# EAGLE design SparkBase (EAGLE 7.1.0)
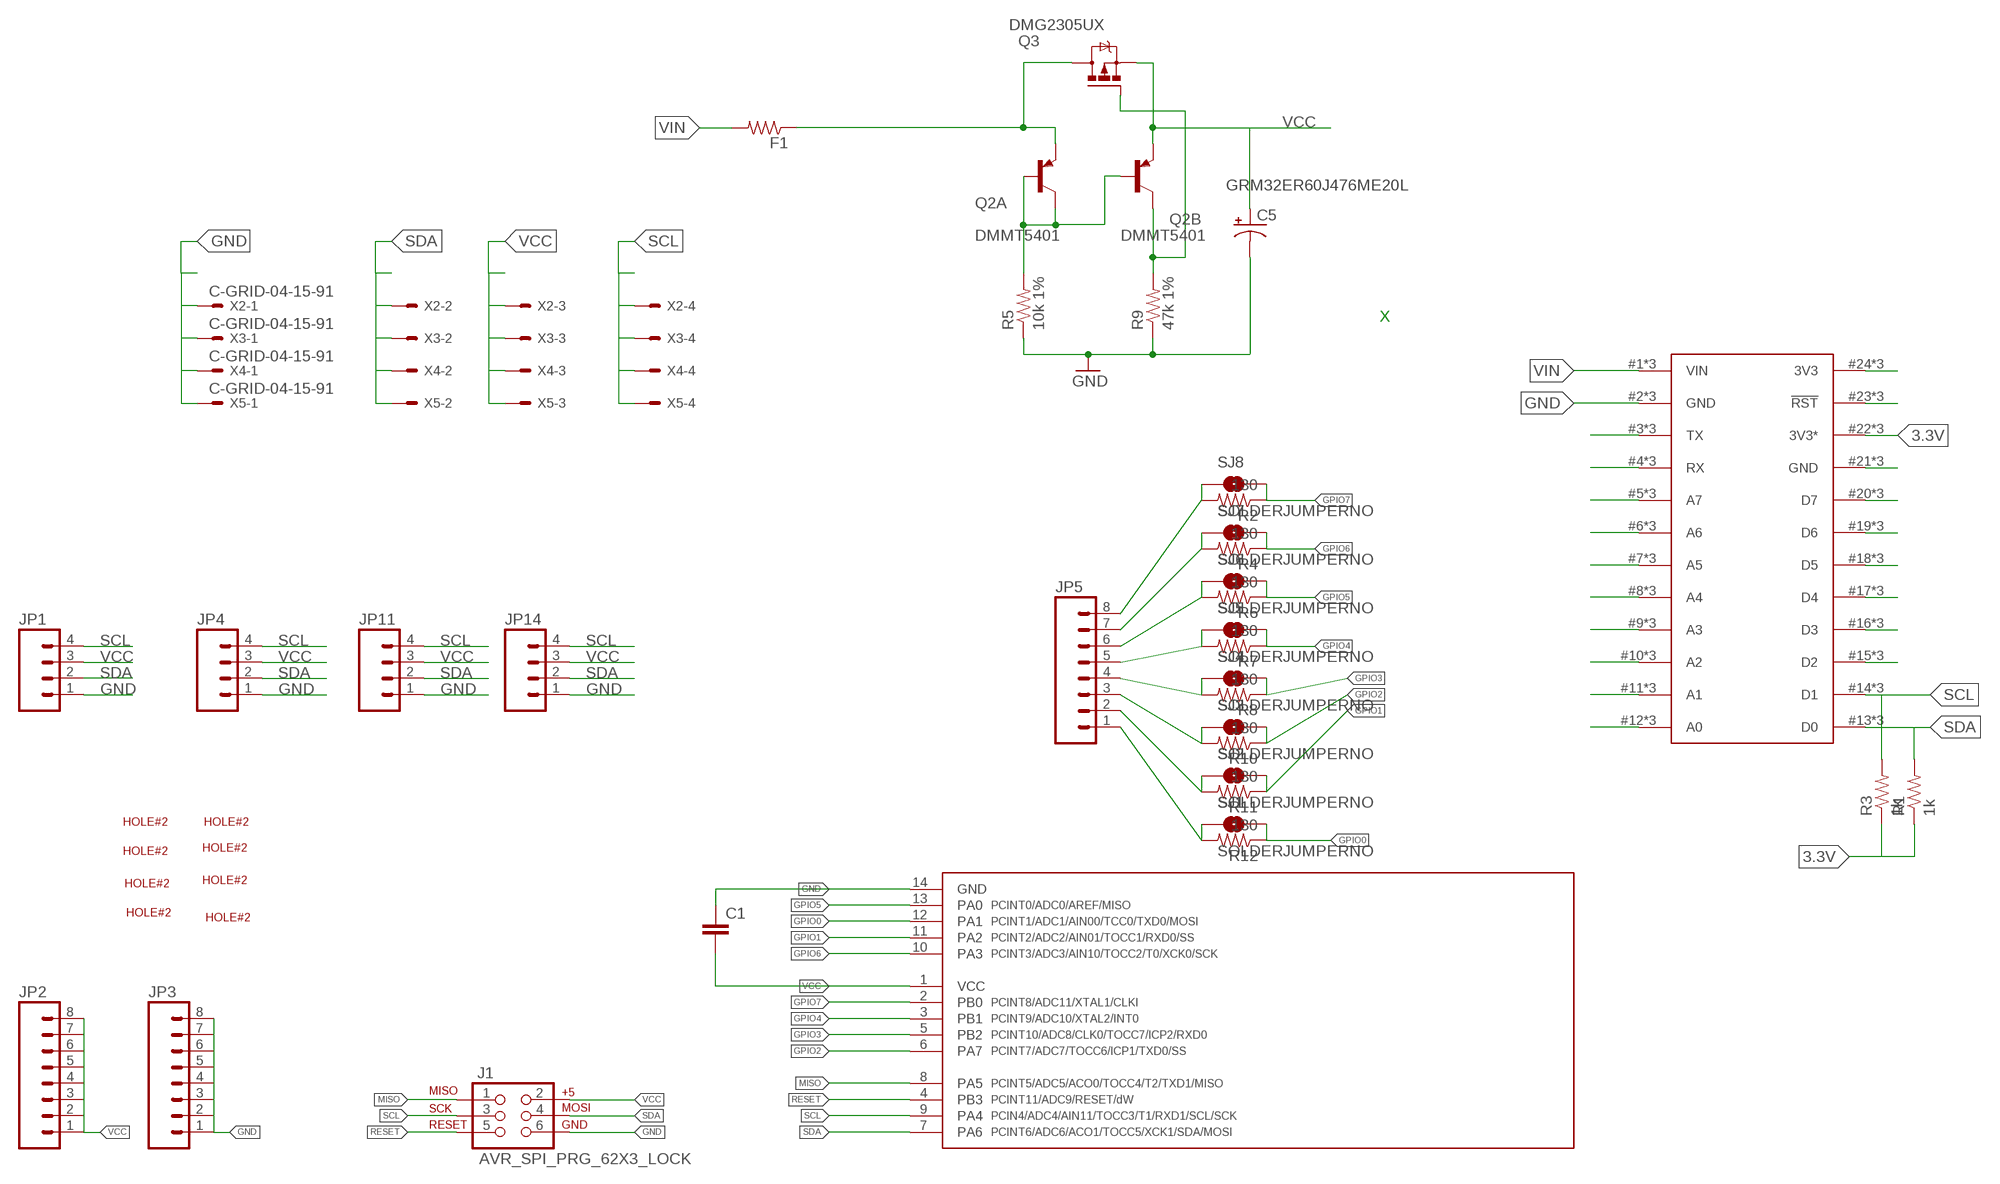
[diagram p0: schematic, sheet 1]

## Parts
C1  CAP0805  [0805]
C5  CAP_POLC  [PANASONIC_C]
F1  RESISTOR0805-RES  [0805]
J1  AVR_SPI_PRG_62X3_LOCK  [2X3_LOCK]
JP1  M04LOCK  [1X04_LOCK]
JP2  M08NO_SILK  [1X08_NO_SILK]
JP3  M08NO_SILK  [1X08_NO_SILK]
JP4  M04LOCK  [1X04_LOCK]
JP5  M08NO_SILK  [1X08_NO_SILK]
JP11  M04LOCK  [1X04_LOCK]
JP14  M04LOCK  [1X04_LOCK]
Q2  DMMT5401  TRANSISTOR-DUAL-PNP  [SOT-26]
Q3  DMG2305UX  IRLML5203  [MICRO3]
R1  1k  RESISTOR0805-RES  [0805]
R2  130  RESISTOR0805-RES  [0805]
R3  1k  RESISTOR0805-RES  [0805]
R4  130  RESISTOR0805-RES  [0805]
R5  10k 1%  RESISTOR0805-RES  [0805]
R6  130  RESISTOR0805-RES  [0805]
R7  130  RESISTOR0805-RES  [0805]
R8  130  RESISTOR0805-RES  [0805]
R9  47k 1%  RESISTOR0805-RES  [0805]
R10  130  RESISTOR0805-RES  [0805]
R11  130  RESISTOR0805-RES  [0805]
R12  130  RESISTOR0805-RES  [0805]
SJ1  SOLDERJUMPERNO  [SJ_2S-NO]
SJ2  SOLDERJUMPERNO  [SJ_2S-NO]
SJ3  SOLDERJUMPERNO  [SJ_2S-NO]
SJ4  SOLDERJUMPERNO  [SJ_2S-NO]
SJ5  SOLDERJUMPERNO  [SJ_2S-NO]
SJ6  SOLDERJUMPERNO  [SJ_2S-NO]
SJ7  SOLDERJUMPERNO  [SJ_2S-NO]
SJ8  SOLDERJUMPERNO  [SJ_2S-NO]
U$2  SPARK_CORE  [SPARK_CORE_STACKABLE]
U$6  TINY841  [SOIC14]
U$7  HOLE#2  [HOLE-#2]
U$8  HOLE#2  [HOLE-#2]
U$9  HOLE#2  [HOLE-#2]
U$10  HOLE#2  [HOLE-#2]
U$11  HOLE#2  [HOLE-#2]
U$12  HOLE#2  [HOLE-#2]
U$13  HOLE#2  [HOLE-#2]
U$14  HOLE#2  [HOLE-#2]
X2  C-GRID-04-15-91  [15-91-04]
X3  C-GRID-04-15-91  [15-91-04]
X4  C-GRID-04-15-91  [15-91-04]
X5  C-GRID-04-15-91  [15-91-04]

## Nets
3.3V: R1.1 R3.1 U$2.22(3V3*) U$2.#22(3V3*) U$2.@22(3V3*)
GND: C1.1 C5.- J1.6 JP1.1 JP3.1 JP3.2 JP3.3 JP3.4 JP3.5 JP3.6 JP3.7 JP3.8 JP4.1 JP11.1 JP14.1 R5.1 R9.1 U$2.2(GND) U$2.#2(GND) U$2.@2(GND) U$6.14(GND) X2.1 X3.1 X4.1 X5.1
GPIO0: R12.1 SJ1.2 U$6.12(PA1)
GPIO1: R11.1 SJ2.2 U$6.11(PA2)
GPIO2: R10.1 SJ3.2 U$6.6(PA7)
GPIO3: R8.1 SJ4.2 U$6.5(PB2)
GPIO4: R7.1 SJ5.2 U$6.3(PB1)
GPIO5: R6.1 SJ6.2 U$6.13(PA0)
GPIO6: R4.1 SJ7.2 U$6.10(PA3)
GPIO7: R2.1 SJ8.2 U$6.2(PB0)
MISO: J1.1 U$6.8(PA5)
N$1: U$2.3(TX) U$2.#3(TX) U$2.@3(TX)
N$2: U$2.4(RX) U$2.#4(RX) U$2.@4(RX)
N$3: U$2.5(A7) U$2.#5(A7) U$2.@5(A7)
N$4: U$2.6(A6) U$2.#6(A6) U$2.@6(A6)
N$5: U$2.7(A5) U$2.#7(A5) U$2.@7(A5)
N$6: U$2.8(A4) U$2.#8(A4) U$2.@8(A4)
N$7: U$2.9(A3) U$2.#9(A3) U$2.@9(A3)
N$8: U$2.10(A2) U$2.#10(A2) U$2.@10(A2)
N$9: U$2.11(A1) U$2.#11(A1) U$2.@11(A1)
N$10: U$2.12(A0) U$2.#12(A0) U$2.@12(A0)
N$11: U$2.24(3V3) U$2.#24(3V3) U$2.@24(3V3)
N$12: U$2.23(!RST) U$2.#23(!RST) U$2.@23(!RST)
N$13: U$2.21(GND) U$2.#21(GND) U$2.@21(GND)
N$14: Q2.1(A:C) Q2.2(A:B) Q2.3(B:B) R5.2
N$15: U$2.20(D7) U$2.#20(D7) U$2.@20(D7)
N$16: Q2.4(B:C) Q3.1(G) R9.2
N$17: U$2.19(D6) U$2.#19(D6) U$2.@19(D6)
N$18: U$2.18(D5) U$2.#18(D5) U$2.@18(D5)
N$19: U$2.17(D4) U$2.#17(D4) U$2.@17(D4)
N$20: U$2.16(D3) U$2.#16(D3) U$2.@16(D3)
N$21: U$2.15(D2) U$2.#15(D2) U$2.@15(D2)
N$22: JP5.1 R12.2 SJ1.1
N$23: JP5.2 R11.2 SJ2.1
N$24: JP5.3 R10.2 SJ3.1
N$25: JP5.4 R8.2 SJ4.1
N$26: JP5.5 R7.2 SJ5.1
N$27: JP5.6 R6.2 SJ6.1
N$28: JP5.7 R4.2 SJ7.1
N$29: JP5.8 R2.2 SJ8.1
RESET: J1.5 U$6.4(PB3)
SCL: J1.3 JP1.4 JP4.4 JP11.4 JP14.4 R3.2 U$2.14(D1) U$2.#14(D1) U$2.@14(D1) U$6.9(PA4) X2.4 X3.4 X4.4 X5.4
SDA: J1.4 JP1.2 JP4.2 JP11.2 JP14.2 R1.2 U$2.13(D0) U$2.#13(D0) U$2.@13(D0) U$6.7(PA6) X2.2 X3.2 X4.2 X5.2
VCC: C1.2 C5.+ J1.2 JP1.3 JP2.1 JP2.2 JP2.3 JP2.4 JP2.5 JP2.6 JP2.7 JP2.8 JP4.3 JP11.3 JP14.3 Q2.5(B:E) Q3.2(S) U$6.1(VCC) X2.3 X3.3 X4.3 X5.3
VIN: F1.2 U$2.1(VIN) U$2.#1(VIN) U$2.@1(VIN)
VREG: F1.1 Q2.6(A:E) Q3.3(D)
Unconnected: U$7.P$1(HOLE) U$8.P$1(HOLE) U$9.P$1(HOLE) U$10.P$1(HOLE) U$11.P$1(HOLE) U$12.P$1(HOLE) U$13.P$1(HOLE) U$14.P$1(HOLE)

## Notes on the sheet
- GRM32ER60J476ME20L
- X

## Library data of the parts
C1 = IntegerLabs:CAP: Capacitor
C5 = IntegerLabs:CAP_POL: Capacitor Polarized These are standard SMD and PTH capacitors. Normally 10uF, 47uF, and 100uF in electrolytic and tantalum varieties. Always verify the external diameter of the through hole cap, it varies with capacity, voltage, and manufacturer. The EIA devices should be standard.
F1 R1-R12 = SparkFun-Passives:RESISTOR: Resistor Basic schematic elements and footprints for 0603, 1206, and PTH resistors.
J1 = SparkFun-Connectors:AVR_SPI_PRG_6: AVR ISP 6 Pin This is the reduced ISP connector for AVR programming. Common on Arduino. This footprint will take up less PCB space and can be used with a 10-pin to 6-pin adapter such as SKU: BOB-08508
JP1 JP4 JP11 JP14 = SparkFun-Connectors:M04: Header 4 Standard 4-pin 0.1" header. Use with straight break away headers (SKU : PRT-00116), right angle break away headers (PRT-00553), swiss pins (PRT-00743), machine pins (PRT-00117), and female headers (PRT-00115). Molex polarized connector foot print use with SKU : PRT-08231 with associated crimp pins and housings. 1MM SMD Version SKU: PRT-10208
JP2 JP3 JP5 = SparkFun-Connectors:M08: Header 8 Standard 8-pin 0.1" header. Use with straight break away headers (SKU : PRT-00116), right angle break away headers (PRT-00553), swiss pins (PRT-00743), machine pins (PRT-00117), and female headers (PRT-00115).
Q2 = IntegerLabs:TRANSISTOR-DUAL-PNP: PNP Transistor
Q3 = transistor-power:IRLML5203: HEXFET P-Channel Power MOSFET
SJ1-SJ8 = SparkFun-Passives:SOLDERJUMPER: Solder Jumper Standard SMD solder jumper. Used to automate production. Two varients : Normally Open and Normally Closed are the same, but have different paste layers. NC will have a large amount of paste and should jumper during reflow.; NOBOM: 1
U$2 = Spark:SPARK_CORE
U$6 = IntegerLabs:TINY841
U$7-U$14 = IntegerLabs:HOLE; NOBOM: 1
X2-X5 = con-molex:C-GRID-04: CONNECTOR wire to board 2.54 mm (0.100") pitch header; OC_FARNELL: unknown; OC_NEWARK: unknown

## Board
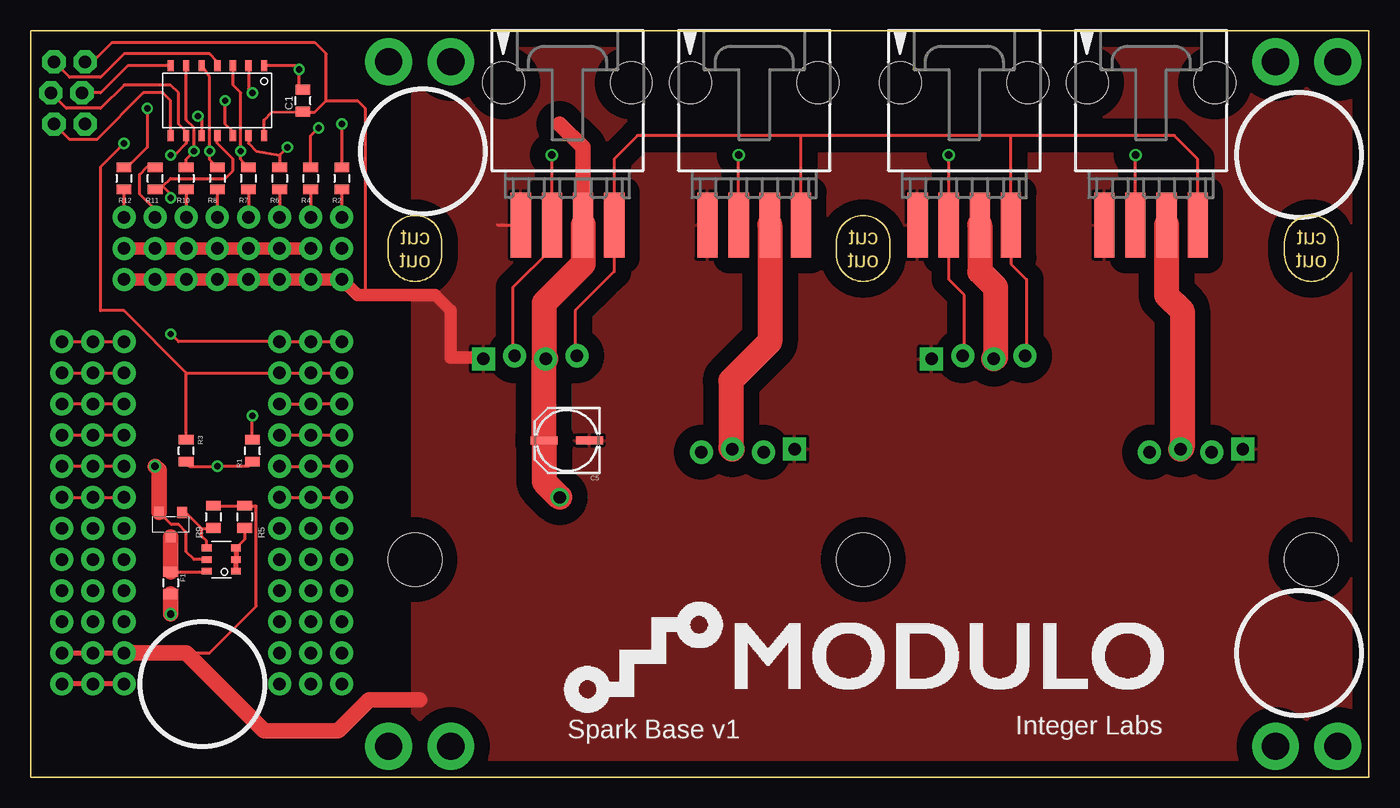
[diagram p1: board, top side]
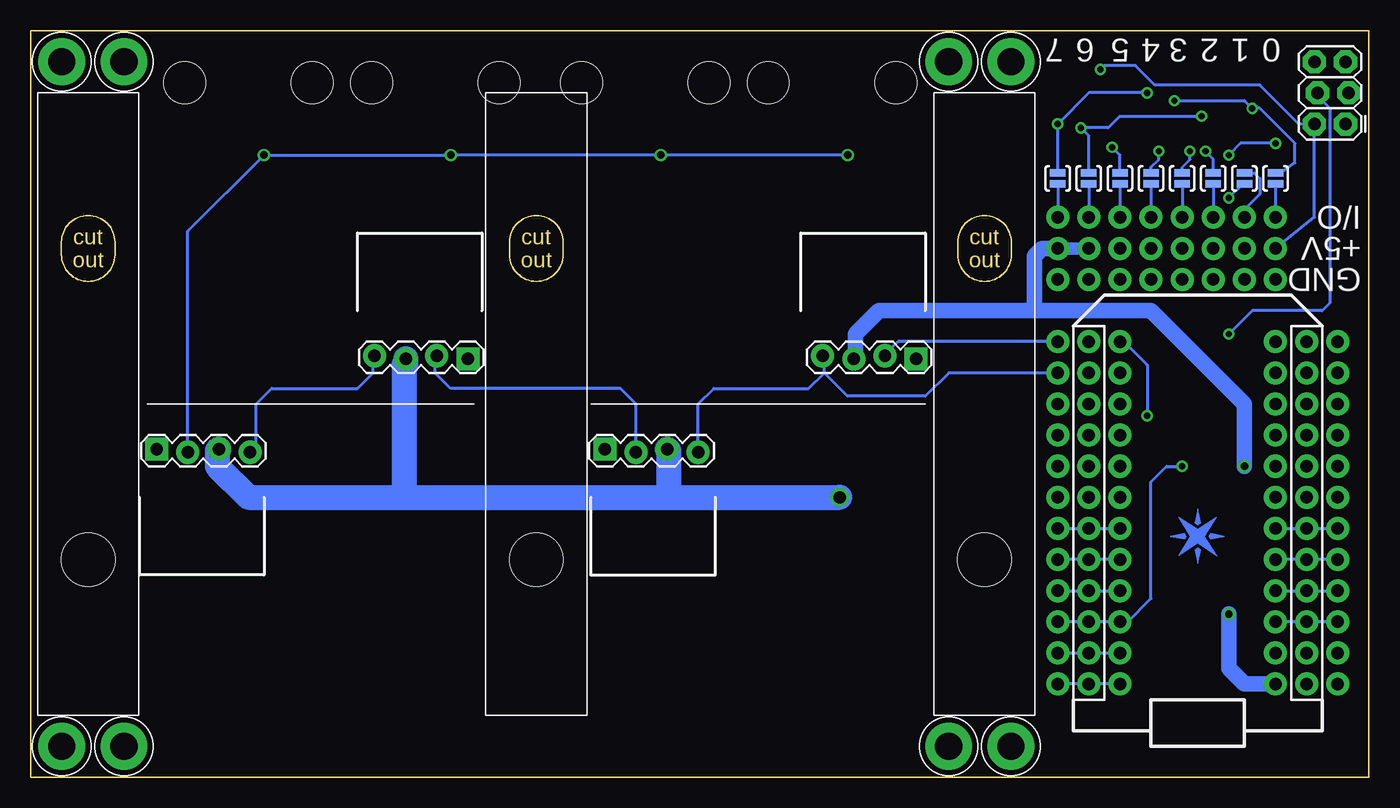
[diagram p2: board, bottom side, seen from below]

Size 109.22 x 60.96 mm. Coordinates in mm from the lower left corner, seen from the top.
Outline: 109.22,0 109.22,60.96 0,60.96 0,0 109.22,0
Copper layers (1*16): Top 0.0178mm / dielectric 59mil / Bottom 0.0178mm
Design rules "SSC-EAGLE-2Lyr_v1.0.0.3 *": minimum track width 6mil, minimum drill 14mil, track to track 6mil, track to pad 6mil, pad to pad 6mil, via to via 6mil, smd to smd 6mil, copper to edge 20mil, drill to drill 16mil, minimum pad ring 8mil, minimum via ring 8mil, stop-mask expansion 3mil, vias tented up to drill 25mil, thermal gap 10mil

### Footprints (pad centres in the part's own frame; a part is rotated, then mirrored left to right if it is on the bottom)
0805 = smd 0.8 x 1.2: 1 -0.9,0; 2 0.9,0
PANASONIC_C = smd 2.2 x 0.65: + 1.9,-0.2; - -1.8,-0.2
2X3_LOCK = drill 1.016 pad 1.88 octagon: 1 0,0; 2 0,2.54; 3 2.54,-0.254; 4 2.54,2.286; 5 5.08,0; 6 5.08,2.54
1X04_LOCK = drill 1.016 pad 1.88 square: 1 0,0.127 | drill 1.016 pad 1.88: 2 2.54,-0.127; 3 5.08,0.127; 4 7.62,-0.127
1X08_NO_SILK = drill 1.016 pad 1.88: 1 0,0; 2 2.54,0; 3 5.08,0; 4 7.62,0; 5 10.16,0; 6 12.7,0; 7 15.24,0; 8 17.78,0
SOT-26 = smd 0.55 x 0.8: 1 -0.95,-1.2; 2 0,-1.2; 3 0.95,-1.2; 4 0.95,1.2; 5 0,1.2; 6 -0.95,1.2
MICRO3 = smd 0.8 x 0.9: 1 -0.95,-1; 2 0.95,-1; 3 0,1
SJ_2S-NO = smd 0.635 x 1.27: 1 -0.45,0; 2 0.45,0
SPARK_CORE_STACKABLE = drill 1.016 pad 1.88: 1 -8.89,13.97; 2 -8.89,11.43; 3 -8.89,8.89; 4 -8.89,6.35; 5 -8.89,3.81; 6 -8.89,1.27; 7 -8.89,-1.27; 8 -8.89,-3.81; 9 -8.89,-6.35; 10 -8.89,-8.89; 11 -8.89,-11.43; 12 -8.89,-13.97; 13 8.89,-13.97; 14 8.89,-11.43; 15 8.89,-8.89; 16 8.89,-6.35; 17 8.89,-3.81; 18 8.89,-1.27; 19 8.89,1.27; 20 8.89,3.81; 21 8.89,6.35; 22 8.89,8.89; 23 8.89,11.43; 24 8.89,13.97; #1 -6.35,13.97; #2 -6.35,11.43; #3 -6.35,8.89; #4 -6.35,6.35; #5 -6.35,3.81; #6 -6.35,1.27; #7 -6.35,-1.27; #8 -6.35,-3.81; #9 -6.35,-6.35; #10 -6.35,-8.89; #11 -6.35,-11.43; #12 -6.35,-13.97; #13 11.43,-13.97; #14 11.43,-11.43; #15 11.43,-8.89; #16 11.43,-6.35; #17 11.43,-3.81; #18 11.43,-1.27; #19 11.43,1.27; #20 11.43,3.81; #21 11.43,6.35; #22 11.43,8.89; #23 11.43,11.43; #24 11.43,13.97; @1 -11.43,13.97; @2 -11.43,11.43; @3 -11.43,8.89; @4 -11.43,6.35; @5 -11.43,3.81; @6 -11.43,1.27; @7 -11.43,-1.27; @8 -11.43,-3.81; @9 -11.43,-6.35; @10 -11.43,-8.89; @11 -11.43,-11.43; @12 -11.43,-13.97; @13 6.35,-13.97; @14 6.35,-11.43; @15 6.35,-8.89; @16 6.35,-6.35; @17 6.35,-3.81; @18 6.35,-1.27; @19 6.35,1.27; @20 6.35,3.81; @21 6.35,6.35; @22 6.35,8.89; @23 6.35,11.43; @24 6.35,13.97
CARD-GUIDE-2" = hole 4.369: 0,-12.7
SOIC14 = smd 0.508 x 0.889: 1 0,-3.175; 2 1.27,-3.175; 3 2.54,-3.175; 4 3.81,-3.175; 5 5.08,-3.175; 6 6.35,-3.175; 7 7.62,-3.175; 8 7.62,2.54; 9 6.35,2.54; 10 5.08,2.54; 11 3.81,2.54; 12 2.54,2.54; 13 1.27,2.54; 14 0,2.54
HOLE-#2 = drill 2.223 pad 3.81: P$1 0,0
15-91-04 = smd 1.651 x 5.334: 1 -3.81,-10.795; 2 -1.27,-10.795; 3 1.27,-10.795; 4 3.81,-10.795 | hole 3.404: -5.207,0.838; 5.207,0.838

### Placement (x,y rotation side)
C1  22.23,55.24 90 top
C5  43.81,27.3 180 top
F1  11.43,15.88 270 top
J1  1.91,53.34 90 bottom
JP1  98.93,26.67 0 bottom
JP2  7.62,43.18 180 bottom
JP3  7.62,40.64 180 bottom
JP4  73.53,34.29 180 bottom
JP5  7.62,45.72 180 bottom
JP11  62.36,26.67 0 bottom
JP14  36.96,34.29 180 bottom
Q2  15.56,17.78 90 top
Q3  11.43,20.64 180 top
R1  18.1,26.67 90 top
R2  25.4,48.9 270 top
R3  12.7,26.67 90 top
R4  22.86,48.9 270 top
R5  17.46,21.27 270 top
R6  20.32,48.9 270 top
R7  17.78,48.9 270 top
R8  15.24,48.9 270 top
R9  14.92,21.27 270 top
R10  12.7,48.9 270 top
R11  10.16,48.9 90 top
R12  7.62,48.9 270 top
SJ1  7.62,48.9 90 bottom
SJ2  10.16,48.9 270 bottom
SJ3  12.7,48.9 90 bottom
SJ4  15.24,48.9 90 bottom
SJ5  17.78,48.9 90 bottom
SJ6  20.32,48.9 90 bottom
SJ7  22.86,48.9 90 bottom
SJ8  25.4,48.9 90 bottom
U$1  [SPARK_LOGO_PLUS_PLANE]  13.97,19.68 0 bottom
U$2  13.97,21.59 180 bottom
U$3  [CARD-GUIDE-2"]  104.52,30.48 0 bottom
U$4  [CARD-GUIDE-2"]  67.94,30.48 0 bottom
U$5  [CARD-GUIDE-2"]  31.37,30.48 0 bottom
U$6  19.05,54.93 180 top
U$7  106.68,2.54 0 bottom
U$8  34.29,58.42 0 bottom
U$9  34.29,2.54 0 bottom
U$10  101.6,2.54 0 bottom
U$11  106.68,58.42 0 bottom
U$12  29.21,58.42 0 bottom
U$13  101.6,58.42 0 bottom
U$14  29.21,2.54 0 bottom
U$15  [LOGO_WITH_TEXT_0.5]  43.18,5.08 0 top
X2  76.2,55.88 0 top
X3  59.05,55.88 0 top
X4  43.81,55.88 0 top
X5  91.44,55.88 0 top

### Tracks (layer width: path | path; a pad name or v marks a point on that pad's centre or on a via)
3.3V  (via drill 0.51 pad 0.25)
  Top 0.254: R1.1 18.1,25.72 17.78,25.4 v15.24,25.4 12.96,25.4 R3.1
  Bottom 0.254: U$2.#22 U$2.22 U$2.@22 19.68,12.7 17.78,14.61 17.78,24.13 16.51,25.4 v15.24,25.4
GND
  Top 0.254: R9.1 R5.1 18.36,22.17 18.41,22.12 18.41,13.97 14.61,10.16 12.7,10.16 | 38.1,45.09 X4.1 | J1.6 5.08,58.42 6.67,60.01 23.18,60.01 24.13,59.05 24.13,55.24 | 24.13,55.24 26.67,55.24 27.3,54.61 27.3,39.37 | U$6.14 19.05,53.66 19.68,54.29 C1.1 22.59,54.34 22.54,54.29 23.18,54.29 24.13,55.24
  Top 0.406: U$2.@2 U$2.2 U$2.#2
  Top 1.016: JP14.1 36.83,34.29 34.29,34.29 34.29,38.1 33.02,39.37 27.3,39.37 26.67,39.37 JP3.8 JP3.7 JP3.6 JP3.5 JP3.4 JP3.3 JP3.2 JP3.1
  Top 1.27: U$2.#2 12.7,10.16 19.05,3.81 25.08,3.81 27.62,6.35 31.75,6.35
  pour Top (isolate 1.27): 109.22,0 109.22,60.96 31.11,60.96 31.11,0
GPIO0  (via drill 0.51 pad 0.25)
  Top 0.254: U$6.12 16.51,52.7 15.88,53.34 v15.88,55.24 | v9.53,54.61 9.53,51.44 7.88,49.8 R12.1
  Bottom 0.254: v15.88,55.24 10.16,55.24 v9.53,54.61 8.89,54.61 6.03,51.75 6.03,50.16 7.17,49.34 SJ1.2
GPIO1  (via drill 0.51 pad 0.25)
  Top 0.254: U$6.11 15.24,51.75 16.51,50.48 16.51,49.53 15.88,48.9 11.43,48.9 10.79,48.26 | R11.1 10.53,47.99 10.79,48.26 | v11.43,47.31 11.43,47.62 10.79,48.26
  Bottom 0.254: SJ2.2 10.29,48.45 v11.43,47.31
GPIO2  (via drill 0.51 pad 0.25)
  Top 0.254: U$6.6 12.7,53.66 13.34,53.02 v13.34,51.12 12.7,50.48 R10.1
  Bottom 0.254: SJ3.2 12.7,50.48 v13.34,51.12
GPIO3  (via drill 0.51 pad 0.25)
  Top 0.254: U$6.5 14.61,57.15 v14.61,51.12 14.61,50.43 R8.1
  Bottom 0.254: SJ4.2 R8.1 14.61,50.43 v14.61,51.12
GPIO4  (via drill 0.51 pad 0.25)
  Top 0.254: U$6.3 16.51,56.52 17.14,55.88 v17.14,51.12 17.14,50.43 R7.1
  Bottom 0.254: SJ5.2 R7.1 17.14,50.43 v17.14,51.12
GPIO5  (via drill 0.51 pad 0.25)
  Top 0.254: U$6.13 17.78,51.75 18.41,51.12 20.32,50.8 | 20.32,50.8 R6.1 | v20.95,51.44 20.32,50.8
  Bottom 0.254: SJ6.2 20.32,50.8 v20.95,51.44
GPIO6  (via drill 0.51 pad 0.25)
  Top 0.254: v13.65,53.98 13.97,53.66 U$6.10 | R4.1 22.86,52.39 v23.5,53.02
  Bottom 0.254: v13.65,53.98 20.32,53.98 21.27,53.02 v23.5,53.02 22.86,52.39 SJ7.2
GPIO7  (via drill 0.51 pad 0.25)
  Top 0.254: U$6.2 17.78,56.2 v18.1,55.88 | v25.4,53.34 R2.1
  Bottom 0.254: v18.1,55.88 22.86,55.88 v25.4,53.34 SJ8.2
MISO
  Top 0.254: U$6.8 11.43,55.24 10.79,55.88 9.21,55.88 5.4,52.07 3.17,52.07 J1.1
N$1
  Bottom 0.254: U$2.@3 U$2.3 U$2.#3
N$2
  Bottom 0.254: U$2.#4 U$2.4 U$2.@4
N$3
  Bottom 0.254: U$2.@5 U$2.5 U$2.#5
N$4
  Bottom 0.254: U$2.#6 U$2.6 U$2.@6
N$5
  Top 0.254: U$2.@7 U$2.7 U$2.#7
N$6
  Top 0.254: U$2.#8 U$2.8 U$2.@8
N$7
  Top 0.254: U$2.@9 U$2.9 U$2.#9
N$8
  Top 0.254: U$2.#10 U$2.10 U$2.@10
N$9
  Top 0.254: U$2.@11 U$2.11 U$2.#11
N$10
  Top 0.254: U$2.@12 U$2.12 U$2.#12
N$11
  Bottom 0.254: U$2.@24 U$2.24 U$2.#24
N$12
  Bottom 0.254: U$2.#23 U$2.23 U$2.@23
N$13
  Bottom 0.254: U$2.#21 U$2.21 U$2.@21
N$14
  Top 0.254: R5.2 17.46,19.43 Q2.3
  Top 0.406: Q2.3 Q2.2 Q2.1
N$15
  Bottom 0.254: U$2.@20 U$2.20 U$2.#20
N$16
  Top 0.254: Q3.1 12.65,21.64 13.97,20.32 | 13.97,20.32 14.87,20.32 R9.2 | Q2.4 14.36,19.3 13.97,19.68 13.97,20.32
N$17
  Bottom 0.254: U$2.#19 U$2.19 U$2.@19
N$18
  Top 0.254: U$2.@18 U$2.18 U$2.#18
N$19
  Top 0.254: U$2.#17 U$2.17 U$2.@17
N$20
  Top 0.254: U$2.@16 U$2.16 U$2.#16
N$21
  Top 0.254: U$2.#15 U$2.15 U$2.@15
N$22
  Top 0.254: JP5.1 R12.2
  Bottom 0.254: SJ1.1 JP5.1
N$23
  Top 0.254: JP5.2 10.16,46.35 8.89,47.62 8.89,49.21 9.53,49.85 10.11,49.85 R11.2
  Bottom 0.254: SJ2.1 9.34,49.34 8.89,48.9 8.89,47.62 10.16,46.35 JP5.2
N$24
  Top 0.254: R10.2 JP5.3
  Bottom 0.254: SJ3.1 JP5.3
N$25
  Top 0.254: R8.2 JP5.4
  Bottom 0.254: SJ4.1 JP5.4
N$26
  Top 0.254: R7.2 JP5.5
  Bottom 0.254: SJ5.1 JP5.5
N$27
  Top 0.254: R6.2 JP5.6
  Bottom 0.254: SJ6.1 JP5.6
N$28
  Top 0.254: R4.2 JP5.7
  Bottom 0.254: SJ7.1 JP5.7
N$29
  Top 0.254: R2.2 JP5.8
  Bottom 0.254: SJ8.1 JP5.8
RESET
  Top 0.254: U$6.4 15.24,58.42 14.61,59.05 7.62,59.05 5.71,57.15 3.17,57.15 J1.5
SCL  (via drill 0.51 pad 0.25)
  Top 0.254: JP4.4 81.28,34.54 81.28,40.64 80.01,41.91 X2.4 80.01,52.39 | X5.4 95.25,50.48 93.34,52.39 80.01,52.39 | 80.01,52.39 62.87,52.39 | 62.87,52.39 49.53,52.39 47.62,50.48 X4.4 47.62,41.27 44.45,38.1 44.45,34.54 JP14.4 | X3.4 62.87,52.39 | R3.2 12.7,33.02 | 12.7,33.02 U$2.@14 U$2.14 U$2.#14 | J1.3 2.92,54.61 5.71,54.61 7.62,56.52 11.43,56.52 12.06,55.88 12.06,53.34 12.7,52.7 U$6.9 12.7,51.75 11.75,50.8 v11.43,50.8 | 12.7,33.02 7.62,38.1 5.71,38.1 5.71,49.85 v7.62,51.75
  Bottom 0.254: JP1.4 90.93,26.54 90.81,26.67 90.81,30.48 89.53,31.75 82.55,31.75 81.28,33.02 81.28,34.29 JP4.4 | JP11.4 54.74,30.48 53.47,31.75 45.72,31.75 44.45,33.02 | 44.45,33.02 44.45,34.29 44.7,34.29 JP14.4 | v7.62,51.75 10.48,51.75 v11.43,50.8 | U$2.#14 34.29,33.02 36.2,31.11 42.55,31.11 44.45,33.02
SDA  (via drill 0.51 pad 0.25, 0.6)
  Top 0.254: JP14.2 39.37,34.54 39.37,40.01 42.55,43.18 X4.2 v42.55,50.8 | v74.93,50.8 X2.2 74.93,40.64 76.2,39.37 76.2,34.92 76.07,34.8 JP4.2 | X5.2 v90.17,50.8 | X3.2 v57.78,50.8 | U$6.7 7.94,58.1 5.71,55.88 J1.4 | U$2.#13 U$2.13 U$2.@13 12.06,35.56 v11.43,36.2 | R1.2 v18.1,29.53
  Bottom 0.254: v42.55,50.8 v57.78,50.8 v74.93,50.8 v90.17,50.8 96.39,44.58 JP1.2 | JP11.2 59.82,30.48 61.09,31.75 74.93,31.75 76.2,33.02 76.2,34.29 JP4.2 | U$2.#13 38.42,35.56 39.37,34.61 39.37,34.54 JP14.2 | J1.4 4.19,55.63 3.17,54.61 3.17,38.73 3.81,38.1 9.53,38.1 v11.43,36.2 | U$2.@13 20,35.56 18.1,33.66 v18.1,29.53
VCC  (via drill 0.51 pad 0.25, 0.6, 1)
  Top 0.254: Q2.5 13.34,17.78 12.7,18.41 12.7,20 12.06,20.64 11.48,20.64 Q3.2 | C1.2 21.96,56.15 21.91,56.2 v21.91,57.78 21.59,58.1 U$6.1
  Top 1.016: JP2.7 JP2.6 JP2.5 JP2.4 JP2.3 JP2.2 JP2.1
  Top 1.27: 43.18,53.34 45.09,51.44 X4.3 | Q3.2 10.48,25.08 v10.16,25.4
  Top 2.032: X2.3 77.47,41.27 78.74,40.01 78.74,34.29 JP4.3 | X5.3 92.71,39.37 93.98,38.1 93.98,26.92 JP1.3 | X3.3 60.33,35.56 57.15,32.38 57.15,26.92 JP11.3 | X4.3 45.09,41.91 41.91,38.73 41.91,34.29 JP14.3 41.91,34.04 C5.+ 41.91,24.12 v43.18,22.86
  Bottom 0.254: v21.91,57.78 21.59,58.1 U$6.1 17.46,56.52 8.89,56.52 5.71,53.34 J1.2 4.45,45.72 JP2.1
  Bottom 1.016: JP2.8 JP2.7
  Bottom 1.27: v10.16,25.4 10.16,30.48 17.78,38.1 27.3,38.1 | JP2.8 26.67,43.18 27.3,42.55 27.3,38.1 | 27.3,38.1 40.01,38.1 41.91,36.2 41.91,34.29 JP14.3
  Bottom 2.032: JP1.3 93.98,26.67 93.98,25.4 91.44,22.86 78.74,22.86 | 78.74,22.86 57.15,22.86 | 57.15,22.86 v43.18,22.86 | JP4.3 78.61,33.78 78.74,33.66 78.74,22.86 | JP11.3 57.15,26.67 57.15,22.86
VIN  (via drill 0.6)
  Top 0.406: U$2.#1 U$2.1 U$2.@1
  Top 1.27: F1.2 v11.43,13.34
  Bottom 1.27: v11.43,13.34 11.43,8.89 10.16,7.62 U$2.#1
VREG
  Top 0.254: F1.1 14.3,16.77 Q2.6
  Top 1.27: F1.1 Q3.3

### Text on the board
tPlace: Spark Base v1 | Integer Labs
bPlace: 0 | 1 | 2 | 3 | 4 | 5 | 6 | 7 | I/O | +5V | GND